# Altium schematic sheet Pan & Tilt Stepper Control.SchDoc
size A3
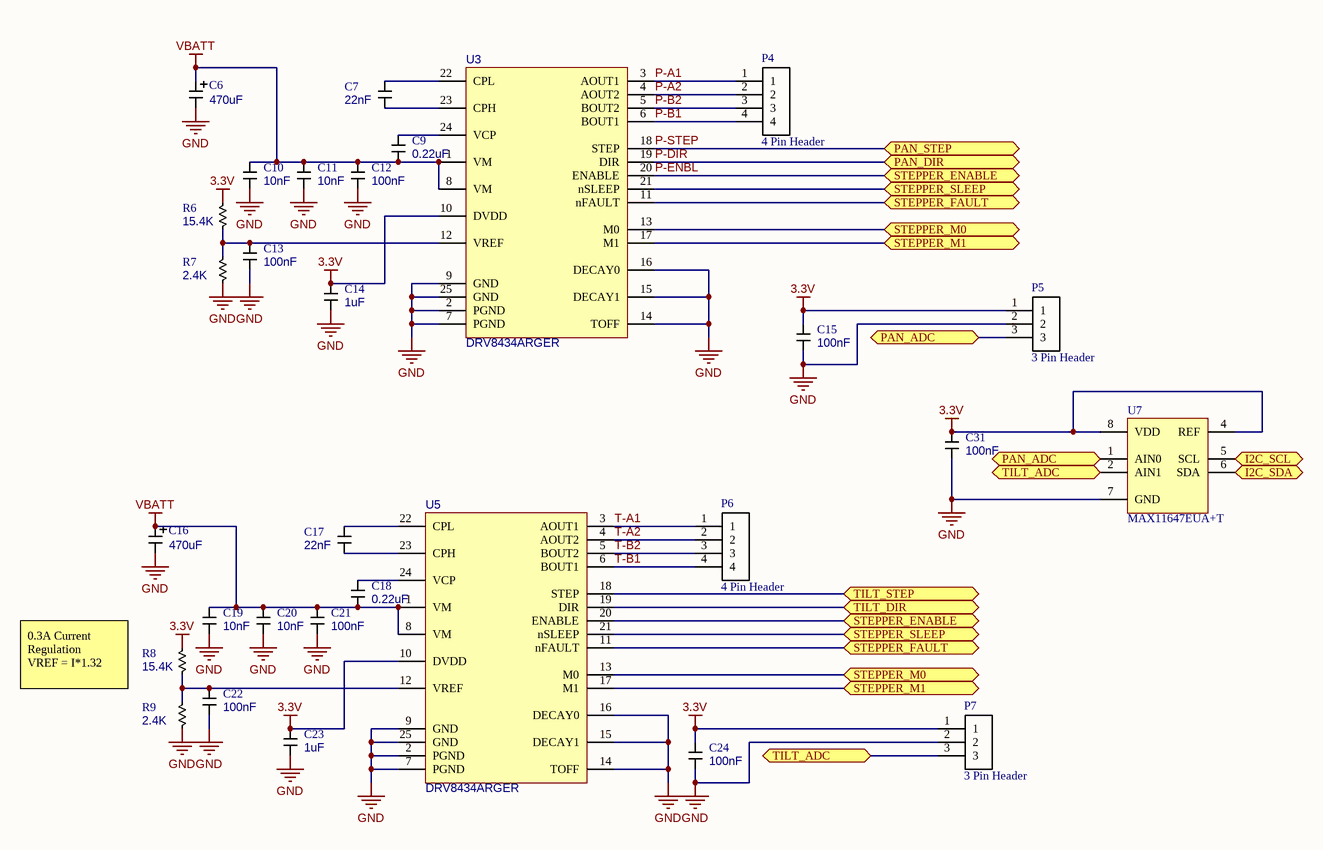
[diagram p0: Pan & Tilt Stepper Control.SchDoc]

## Parts
?  (no value)
C6  Capacitance: 470uF  [Panasonic EEE-FT1E471AP]  (hidden comment: F)
C7  Capacitance: 22nF  [C0805]  (hidden comment: F)
C9  Capacitance: 0.22uF  [C0805]  (hidden comment: F)
C10  Capacitance: 10nF  [C0805]  (hidden comment: F)
C11  Capacitance: 10nF  [C0805]  (hidden comment: F)
C12  Capacitance: 100nF  [C0805]  (hidden comment: F)
C13  Capacitance: 100nF  [C0805]  (hidden comment: F)
C14  Capacitance: 1uF  [C0805]  (hidden comment: F)
C15  Capacitance: 100nF  [C0805]  (hidden comment: F)
C16  Capacitance: 470uF  [Panasonic EEE-FT1E471AP]  (hidden comment: F)
C17  Capacitance: 22nF  [C0805]  (hidden comment: F)
C18  Capacitance: 0.22uF  [C0805]  (hidden comment: F)
C19  Capacitance: 10nF  [C0805]  (hidden comment: F)
C20  Capacitance: 10nF  [C0805]  (hidden comment: F)
C21  Capacitance: 100nF  [C0805]  (hidden comment: F)
C22  Capacitance: 100nF  [C0805]  (hidden comment: F)
C23  Capacitance: 1uF  [C0805]  (hidden comment: F)
C24  Capacitance: 100nF  [C0805]  (hidden comment: F)
C31  Capacitance: 100nF  [C0805]  (hidden comment: F)
P4  4 Pin Header  [B4B-XH-A]
P5  3 Pin Header  [B3B-XH-A]
P6  4 Pin Header  [B4B-XH-A]
P7  3 Pin Header  [B3B-XH-A]
R6  Resistance: 15.4K  [R0805]  (hidden comment: 330Ω)
R7  Resistance: 2.4K  [R0805]  (hidden comment: 330Ω)
R8  Resistance: 15.4K  [R0805]  (hidden comment: 330Ω)
R9  Resistance: 2.4K  [R0805]  (hidden comment: 330Ω)
U3  DRV8434ARGER  [DRV8434ARGER]
U5  DRV8434ARGER  [DRV8434ARGER]
U7  MAX11647EUA+T  [MAX11647EUA+T]

## Ports
I2C_SCL, I2C_SDA, PAN_ADC, PAN_DIR, PAN_STEP, STEPPER_ENABLE, STEPPER_FAULT, STEPPER_M0, STEPPER_M1, STEPPER_SLEEP, TILT_ADC, TILT_DIR, TILT_STEP

## Nets
3.3V: C14.1 C15.1 C23.1 C24.1 C31.1 P5.1 P7.1 R6.2 R8.2 U3.10(DVDD) U5.10(DVDD) U7.4(REF) U7.8(VDD)
GND: C6.2 C10.2 C11.2 C12.2 C13.2 C14.2 C15.2 C16.2 C19.2 C20.2 C21.2 C22.2 C23.2 C24.2 C31.2 P5.2 P7.2 R7.1 R9.1 U3.2(PGND) U3.7(PGND) U3.9(GND) U3.14(TOFF) U3.15(DECAY1) U3.16(DECAY0) U3.25(GND) U5.2(PGND) U5.7(PGND) U5.9(GND) U5.14(TOFF) U5.15(DECAY1) U5.16(DECAY0) U5.25(GND) U7.7(GND)
VBATT: C6.1 C9.2 C10.1 C11.1 C12.1 C16.1 C18.2 C19.1 C20.1 C21.1 U3.1(VM) U3.8(VM) U5.1(VM) U5.8(VM)
I2C_SCL: U7.5(SCL) ; port I2C_SCL
I2C_SDA: U7.6(SDA) ; port I2C_SDA
P-A1: P4.1 U3.3(AOUT1)
P-A2: P4.2 U3.4(AOUT2)
P-B1: P4.4 U3.6(BOUT1)
P-B2: P4.3 U3.5(BOUT2)
P-DIR: U3.19(DIR) ; port PAN_DIR
P-ENBL: U3.20(ENABLE) U5.20(ENABLE) ; port STEPPER_ENABLE
P-STEP: U3.18(STEP) ; port PAN_STEP
PAN_ADC: P5.3 U7.1(AIN0) ; port PAN_ADC
STEPPER_FAULT: U3.11(nFAULT) U5.11(nFAULT) ; port STEPPER_FAULT
STEPPER_M0: U3.13(M0) U5.13(M0) ; port STEPPER_M0
STEPPER_M1: U3.17(M1) U5.17(M1) ; port STEPPER_M1
STEPPER_SLEEP: U3.21(nSLEEP) U5.21(nSLEEP) ; port STEPPER_SLEEP
T-A1: P6.1 U5.3(AOUT1)
T-A2: P6.2 U5.4(AOUT2)
T-B1: P6.4 U5.6(BOUT1)
T-B2: P6.3 U5.5(BOUT2)
TILT_ADC: P7.3 U7.2(AIN1) ; port TILT_ADC
TILT_DIR: U5.19(DIR) ; port TILT_DIR
TILT_STEP: U5.18(STEP) ; port TILT_STEP
NetC7_1: C7.1 U3.22(CPL)
NetC7_2: C7.2 U3.23(CPH)
NetC9_1: C9.1 U3.24(VCP)
NetC13_1: C13.1 R6.1 R7.2 U3.12(VREF)
NetC17_1: C17.1 U5.22(CPL)
NetC17_2: C17.2 U5.23(CPH)
NetC18_1: C18.1 U5.24(VCP)
NetC22_1: C22.1 R8.1 R9.2 U5.12(VREF)

## Notes on the sheet
- 0.3A Current Regulation
  VREF = I*1.32
- DRAWN BY
- CHECKED BY
- DATE
- TITLE
- Title
- Size:
- Date:
- A3
- Number:
- Time:
- Revision:
- Sheet
- of
- APPROVED BY
- RELEASED BY
- SCALE:
- SIZE
- DRAWING NUMBER
- SHEET
- -
- OF
- File:

## Library data of the parts
? = Title Block
C6 C16 = Capacitor Polarized: Polarized Capacitor; Manufacturer: Panasonic Electronic Components; Manufacturer Part Number: EEE-FT1E471AP; Voltage Rating: 25V; Supplier: Digi-Key Electronics; Supplier Part Number: PCE5010CT-ND
C7 C17 = Capacitor: Manufacturer: TDK Corporation; Manufacturer Part Number: CGA4J3X7R2E223K125AA; Voltage Rating: 250V; Supplier: Digi-Key Electronics; Supplier Part Number: 445-5836-1-ND; Price: 0.16
C9 C18 = Capacitor: Manufacturer: KEMET; Manufacturer Part Number: C0805C224K5RAC7800; Voltage Rating: 50V; Supplier: Digi-Key Electronics; Supplier Part Number: 399-C0805C224K5RACTUCT-ND; Price: 0.24
C10 C11 C19 C20 = Capacitor: Manufacturer: YAGEO; Manufacturer Part Number: CC0805KRX7R9BB103; Voltage Rating: 50V; Supplier: Digi-Key Electronics; Supplier Part Number: 311-1136-1-ND; Price: 0.16
C12 C13 C15 C21 C22 C24 C31 = Capacitor: Manufacturer: Samsung Electro-Mechanics; Manufacturer Part Number: CL21B104KBCNNNC; Voltage Rating: 50V; Supplier: Digi-Key Electronics; Supplier Part Number: 1276-1003-1-ND; Price: 0.16
C14 C23 = Capacitor: Manufacturer: Samsung Electro-Mechanics; Manufacturer Part Number: CL21B105KAFNNNE; Voltage Rating: 25V; Supplier: Digi-Key Electronics; Supplier Part Number: 1276-1066-1-ND; Price: 0.16
P4 P6 = Header 4: Manufacturer: JST; Manufacturer Part Number: B4B-XH-2; Supplier: Digi-Key Electronics; Supplier Part Number: 455-B4B-XH-A-ND
P5 P7 = Header 3: Manufacturer: JST Sales America Inc.; Supplier: Digi-Key Electronics; Supplier Part Number: 455-2248-ND; Manufacturer Part Number: B3B-XH-A
R6 R8 = Resistor: Standard Resistor; Manufacturer: Vishay Dale; Manufacturer Part Number: CRCW080515K4FKEA; Power Rating: 1/8W; Supplier: Digi-Key Electronics; Supplier Part Number: 541-15.4KCCT-ND; Price: 0.16
R7 R9 = Resistor: Standard Resistor; Manufacturer: Vishay Dale; Manufacturer Part Number: CRCW08052K10FKEA; Power Rating: 1/8W; Supplier: Digi-Key Electronics; Supplier Part Number: 541-2.10KCCT-ND; Price: 0.16
U3 U5 = DRV8434ARGER: Bipolar Motor Driver NMOS Step/Direction 24-VQFN (4x4); Manufacturer: Texas Instruments; Supplier: Digi-Key Electronics; Supplier Part Number: 296-DRV8434ARGERCT-ND; Manufacturer Part Number: DRV8434ARGER
U7 = MAX11647EUA+T: 10 Bit Analog to Digital Converter 1, 2 Input 1 SAR 8-uMAX/uSOP; Manufacturer: Analog Devices Inc./Maxim Integrated; Supplier: Digi-Key Electronics; Supplier Part Number: 175-MAX11647EUA+TCT-ND; Manufacturer Part Number: MAX11647EUA+T